# Altium schematic sheet MCLR_AVR.SchDoc
size A
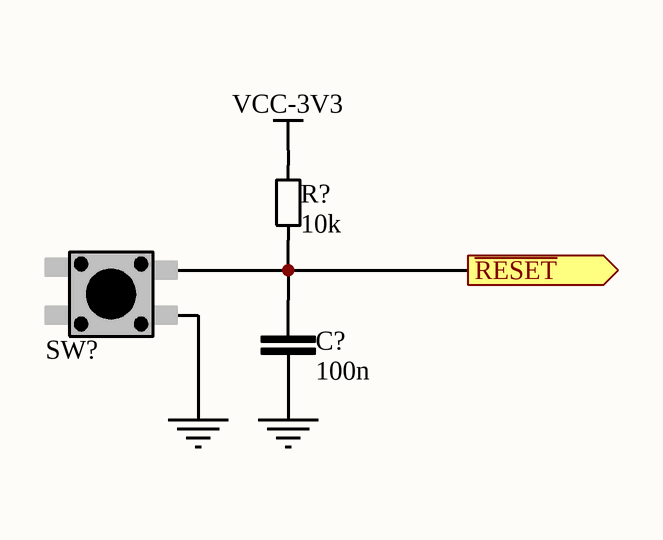
[diagram p0: MCLR_AVR.SchDoc]

## Parts
C?  100n  [CER_0603]
R?  10k  [RESC2013X38N-0805-NOOVERLAY]
SW?  TASTER  [TASTER_SMD]  (value not drawn)

## Ports
~{RESET} (out)

## Nets
GND: C?.1 SW?.1
VCC-3V3: R?.2
~{RESET}: C?.2 R?.1 SW?.2 ; port ~{RESET}

## Library data of the parts
C? = 06032105: CAP CER 100n 10V X5R 10% 0603; Capacitance: 100n
R? = 000001002: RES SMD 10 kOhm 1/8W 0805; Resistance: 10k